# Altium schematic sheet 190822 Top Level.SchDoc
size A4
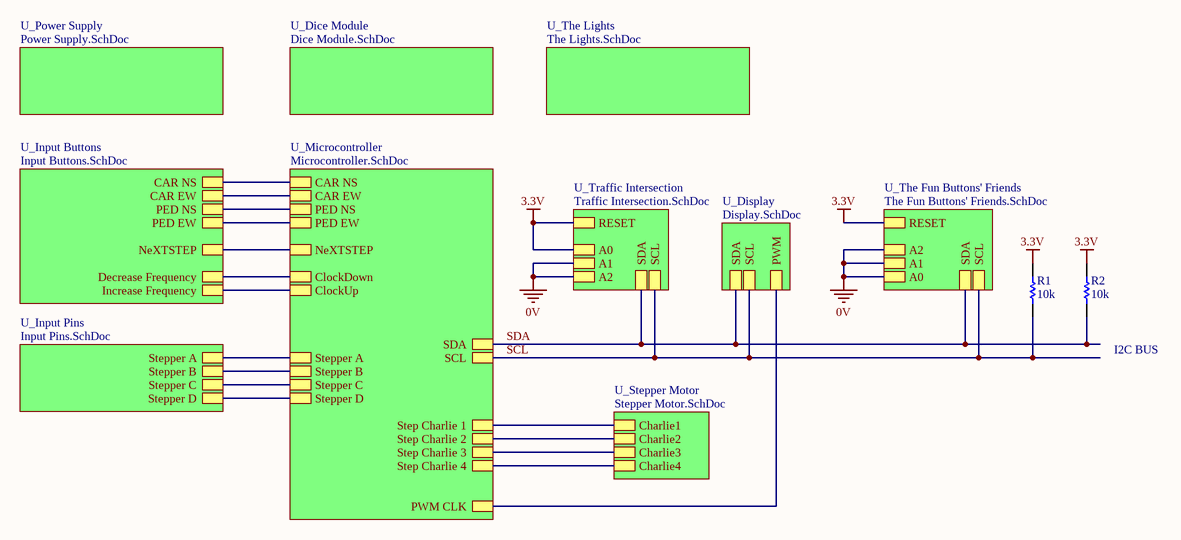
[diagram p0: 190822 Top Level.SchDoc]

## Parts
R1  10k  [0805]
R2  10k  [0805]

## Sub-sheets
U_Dice Module = Dice Module.SchDoc: no entries
U_Display = Display.SchDoc: SCL, SDA, PWM
U_Input Buttons = Input Buttons.SchDoc: CAR NS, CAR EW, PED NS, PED EW, NeXTSTEP, Decrease Frequency, Increase Frequency
U_Input Pins = Input Pins.SchDoc: Stepper D, Stepper C, Stepper B, Stepper A
U_Microcontroller = Microcontroller.SchDoc: SDA, SCL, CAR NS, CAR EW, PED NS, PED EW, Stepper A, Stepper B, Stepper C, Stepper D, Step Charlie 1, Step Charlie 2, Step Charlie 4, Step Charlie 3, PWM CLK, NeXTSTEP, ClockDown, ClockUp
U_Power Supply = Power Supply.SchDoc: no entries
U_Stepper Motor = Stepper Motor.SchDoc: Charlie1, Charlie2, Charlie3, Charlie4
U_The Fun Buttons' Friends = The Fun Buttons' Friends.SchDoc: SDA, SCL, RESET, A0, A1, A2
U_The Lights = The Lights.SchDoc: no entries
U_Traffic Intersection = Traffic Intersection.SchDoc: A0, A1, A2, RESET, SDA, SCL

## Nets
0V: sheet U_Traffic Intersection/A1, sheet U_Traffic Intersection/A2, sheet U_The Fun Buttons' Friends/A0, sheet U_The Fun Buttons' Friends/A1, sheet U_The Fun Buttons' Friends/A2
3.3V: R1.1 R2.1 ; sheet U_Traffic Intersection/A0, sheet U_Traffic Intersection/RESET, sheet U_The Fun Buttons' Friends/RESET
SCL: R1.2 ; sheet U_Microcontroller/SCL, sheet U_Traffic Intersection/SCL, sheet U_Display/SCL, sheet U_The Fun Buttons' Friends/SCL
SDA: R2.2 ; sheet U_Microcontroller/SDA, sheet U_Traffic Intersection/SDA, sheet U_Display/SDA, sheet U_The Fun Buttons' Friends/SDA
(unnamed): sheet U_Input Buttons/CAR NS, sheet U_Microcontroller/CAR NS
(unnamed): sheet U_Input Buttons/CAR EW, sheet U_Microcontroller/CAR EW
(unnamed): sheet U_Input Buttons/PED NS, sheet U_Microcontroller/PED NS
(unnamed): sheet U_Input Buttons/PED EW, sheet U_Microcontroller/PED EW
(unnamed): sheet U_Input Buttons/NeXTSTEP, sheet U_Microcontroller/NeXTSTEP
(unnamed): sheet U_Input Buttons/Decrease Frequency, sheet U_Microcontroller/ClockDown
(unnamed): sheet U_Input Buttons/Increase Frequency, sheet U_Microcontroller/ClockUp
(unnamed): sheet U_Input Pins/Stepper D, sheet U_Microcontroller/Stepper D
(unnamed): sheet U_Input Pins/Stepper C, sheet U_Microcontroller/Stepper C
(unnamed): sheet U_Input Pins/Stepper B, sheet U_Microcontroller/Stepper B
(unnamed): sheet U_Input Pins/Stepper A, sheet U_Microcontroller/Stepper A
(unnamed): sheet U_Microcontroller/Step Charlie 1, sheet U_Stepper Motor/Charlie1
(unnamed): sheet U_Microcontroller/Step Charlie 2, sheet U_Stepper Motor/Charlie2
(unnamed): sheet U_Microcontroller/Step Charlie 4, sheet U_Stepper Motor/Charlie4
(unnamed): sheet U_Microcontroller/Step Charlie 3, sheet U_Stepper Motor/Charlie3
(unnamed): sheet U_Microcontroller/PWM CLK, sheet U_Display/PWM

## Notes on the sheet
- (near R2) I2C BUS
- Title
- Size:
- Date:
- A4
- Number:
- Time:
- Revision:
- Sheet
- of
- File:

## Library data of the parts
R1 R2 = RC0805FR0710KL: Manufacturer: YAGEO; Tolerance: 0.01; Rated Voltage: 0.125W; Part Number: RC0805FR0710KL; Value: 10k; Material: FR-07; qty: 50